# EAGLE design STM32_H103_Extension (EAGLE 6.4)
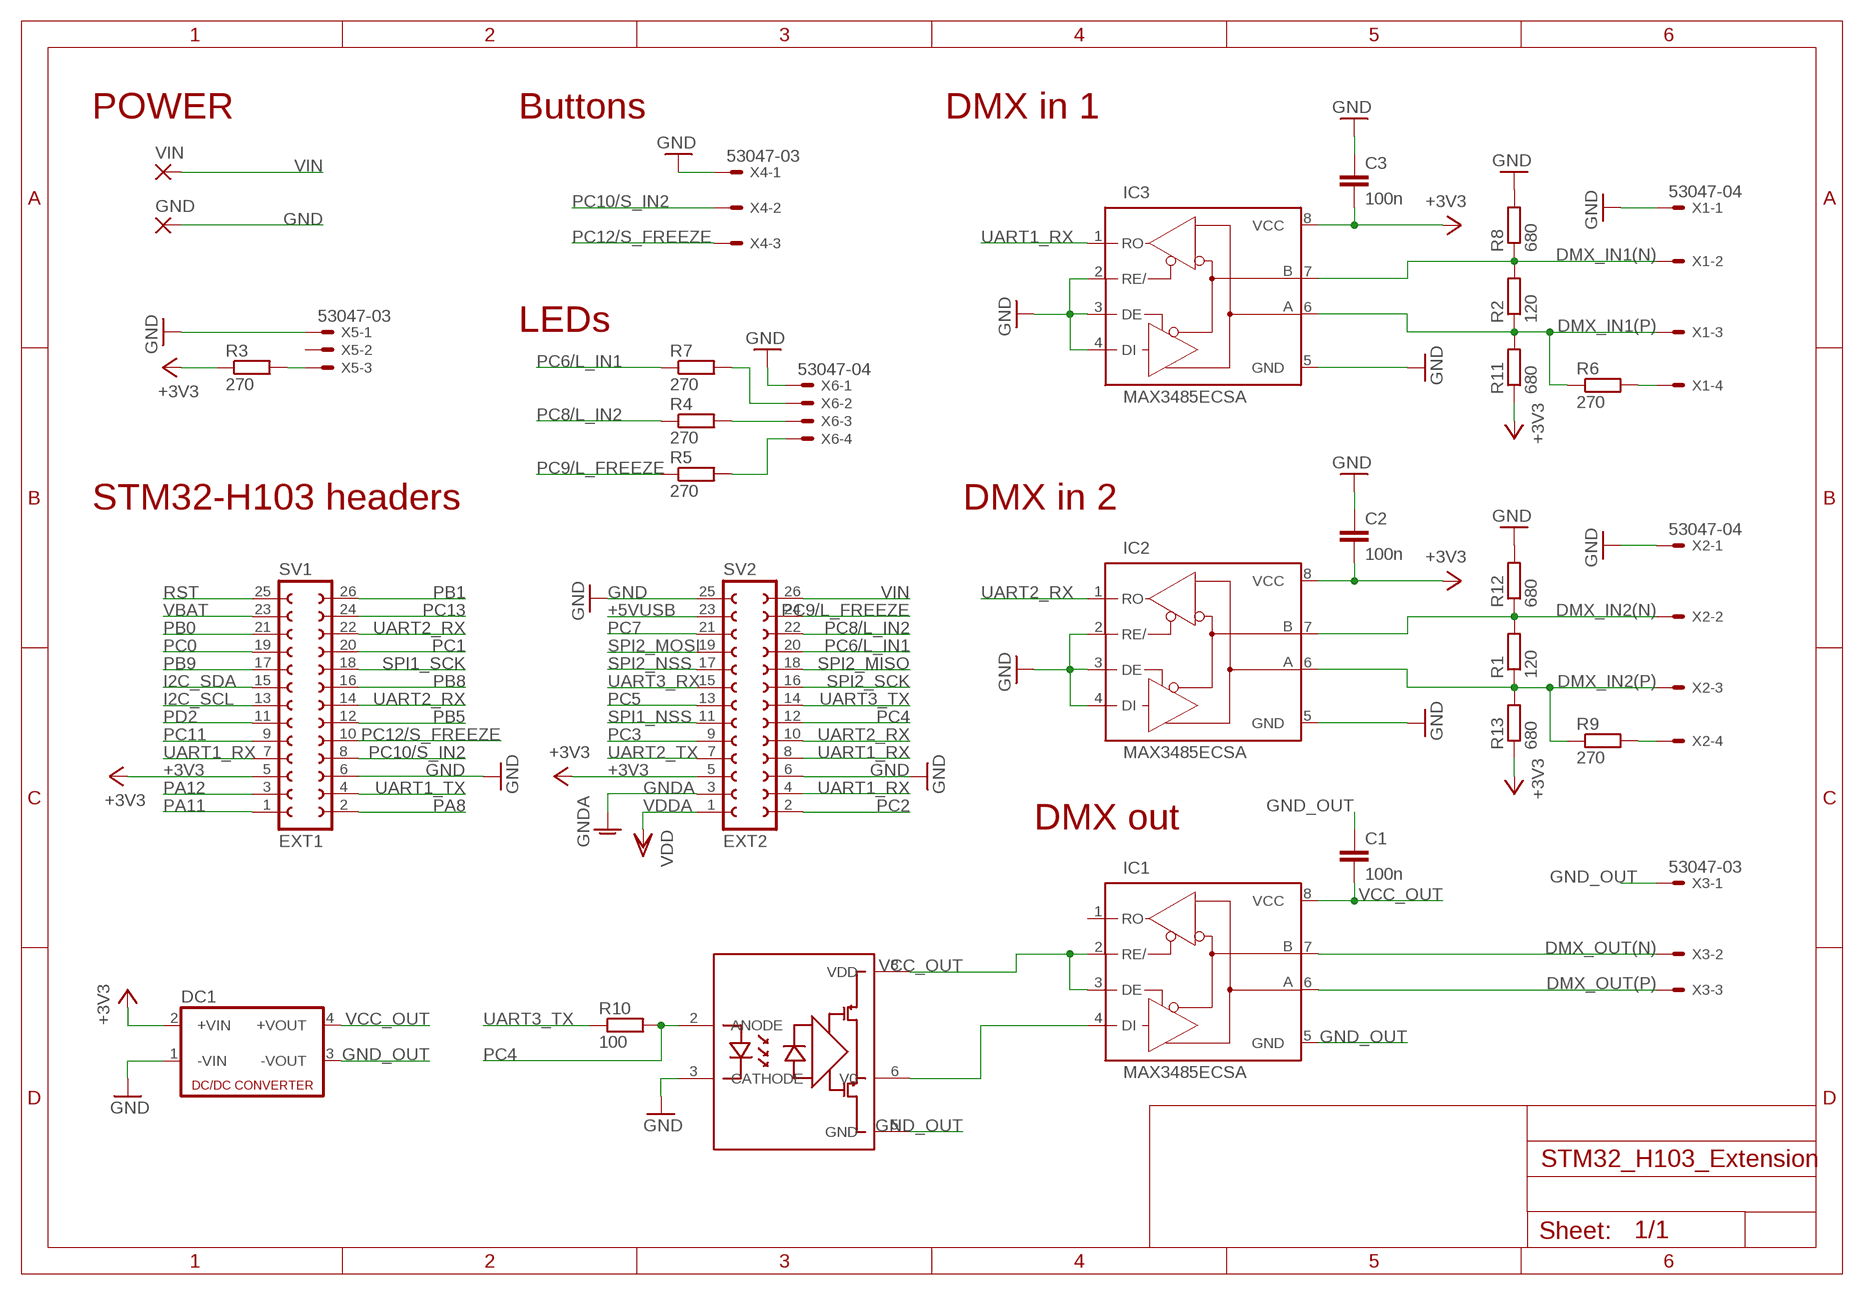
[diagram p0: schematic, sheet 1]

## Parts
C1  100n  C-EUC0603  [C0603]
C2  100n  C-EUC0603  [C0603]
C3  100n  C-EUC0603  [C0603]
DC1  NME  [NME]
GND  2,15/1,0  [2,15/1,0]
IC1  MAX3485ECSA  MAX3468ESA  [SO08]
IC2  MAX3485ECSA  MAX3468ESA  [SO08]
IC3  MAX3485ECSA  MAX3468ESA  [SO08]
R1  120  R-EU_R0603  [R0603]
R2  120  R-EU_R0603  [R0603]
R3  270  R-EU_R0603  [R0603]
R4  270  R-EU_R0603  [R0603]
R5  270  R-EU_R0603  [R0603]
R6  270  R-EU_R0603  [R0603]
R7  270  R-EU_R0603  [R0603]
R8  680  R-EU_R0603  [R0603]
R9  270  R-EU_R0603  [R0603]
R10  100  R-EU_R0603  [R0603]
R11  680  R-EU_R0603  [R0603]
R12  680  R-EU_R0603  [R0603]
R13  680  R-EU_R0603  [R0603]
SV1  EXT1  FE13-2  [FE13-2]
SV2  EXT2  FE13-2  [FE13-2]
U1  ACPL-071L  [SOIC-8]
VIN  2,15/1,0  [2,15/1,0]
X1  53047-04  [53047-04]
X2  53047-04  [53047-04]
X3  53047-03  [53047-03]
X4  53047-03  [53047-03]
X5  53047-03  [53047-03]
X6  53047-04  [53047-04]

## Nets
+3V3 [supply]: C2.2 C3.2 DC1.2(+VIN) IC2.8(VCC) IC3.8(VCC) R3.1 R11.1 R13.1 SV1.5 SV2.5
+5VUSB: SV2.23
DMX_IN1(N): IC3.7(B) R2.2 R8.1 X1.2
DMX_IN1(P): IC3.6(A) R2.1 R6.1 R11.2 X1.3
DMX_IN2(N): IC2.7(B) R1.2 R12.1 X2.2
DMX_IN2(P): IC2.6(A) R1.1 R9.1 R13.2 X2.3
DMX_OUT(N): IC1.7(B) X3.2
DMX_OUT(P): IC1.6(A) X3.3
GND: C2.1 C3.1 DC1.1(-VIN) GND.1(P) IC2.2(RE/) IC2.3(DE) IC2.4(DI) IC2.5(GND) IC3.2(RE/) IC3.3(DE) IC3.4(DI) IC3.5(GND) R8.2 R12.2 SV1.6 SV2.6 SV2.25 U1.3(CATHODE) X1.1 X2.1 X4.1 X5.1 X6.1
GND_OUT: C1.1 DC1.3(-VOUT) IC1.5(GND) U1.5(GND) X3.1
GNDA: SV2.3
I2C_SCL: SV1.13
I2C_SDA: SV1.15
N$1: R3.2 X5.3
N$2: R4.2 X6.3
N$3: R5.2 X6.4
N$4: R7.2 X6.2
N$5: IC1.4(DI) U1.6(V0)
N$7: R6.2 X1.4
N$8: R9.2 X2.4
PA8: SV1.2
PA11: SV1.1
PA12: SV1.3
PB0: SV1.21
PB1: SV1.26
PB5: SV1.12
PB8: SV1.16
PB9: SV1.17
PC0: SV1.19
PC1: SV1.20
PC2: SV2.2
PC3: SV2.9
PC4: R10.2 SV2.12 U1.2(ANODE)
PC5: SV2.13
PC6/L_IN1: R7.1 SV2.20
PC7: SV2.21
PC8/L_IN2: R4.1 SV2.22
PC9/L_FREEZE: R5.1 SV2.24
PC10/S_IN2: SV1.8 X4.2
PC11: SV1.9
PC12/S_FREEZE: SV1.10 X4.3
PC13: SV1.24
PD2: SV1.11
RST: SV1.25
SPI1_NSS: SV2.11
SPI1_SCK: SV1.18
SPI2_MISO: SV2.18
SPI2_MOSI: SV2.19
SPI2_NSS: SV2.17
SPI2_SCK: SV2.16
UART1_RX: IC3.1(RO) SV1.7 SV2.4 SV2.8
UART1_TX: SV1.4
UART2_RX: IC2.1(RO) SV1.14 SV1.22 SV2.10
UART2_TX: SV2.7
UART3_RX: SV2.15
UART3_TX: R10.1 SV2.14
VBAT: SV1.23
VCC_OUT [supply]: C1.2 DC1.4(+VOUT) IC1.2(RE/) IC1.3(DE) IC1.8(VCC) U1.8(VDD)
VDDA: SV2.1 ; supply symbol labelled VDD
VIN: SV2.26 VIN.1(P)
Unconnected: IC1.1(RO) X5.2

## Notes on the sheet
- POWER | Buttons | DMX in 1
- LEDs
- STM32-H103 headers | DMX in 2
- DMX out

## Library data of the parts
C1-C3 = resistor:C-EU: CAPACITOR, European symbol
DC1 = dc-dc-converter:NME: DC-DC CONVERTER; MF: C & D TECHNOLOGIES, INC; MPN: NME1205D; OC_FARNELL: 1021466; OC_NEWARK: 98B8198
GND VIN = wirepad:2,15/1,0: THROUGH-HOLE PAD
IC1-IC3 = maxim:MAX34*: +5V, Fail-Safe, 40Mbps, Profibus RS-485/RS-422 Transceivers Source: MAX3465-MAX3469.pdf; MPN: MAX3468ESA+T; OC_FARNELL: unknown; OC_NEWARK: 76K6724
R1-R13 = resistor:R-EU_: RESISTOR, European symbol
SV1 SV2 = con-lsta:FE13-2: FEMALE HEADER; OC_FARNELL: unknown; OC_NEWARK: unknown
U1 = ACPL-071L:ACPL-071L
X1 X2 X6 = con-molex:53?-04: CONNECTOR wire to board 1.25 mm (.049 inch) pitch header; MF: WALDOM/MOLEX; MPN: 53047-0410; OC_FARNELL: 9733060; OC_NEWARK: 38C9900
X3-X5 = con-molex:53?-03: CONNECTOR wire to board 1.25 mm (.049 inch) pitch header; MPN: 530470310; OC_FARNELL: 9732853; OC_NEWARK: 14R5412

## Net classes
1 supply: width 0.305 mm, clearance 0.254 mm

## Board
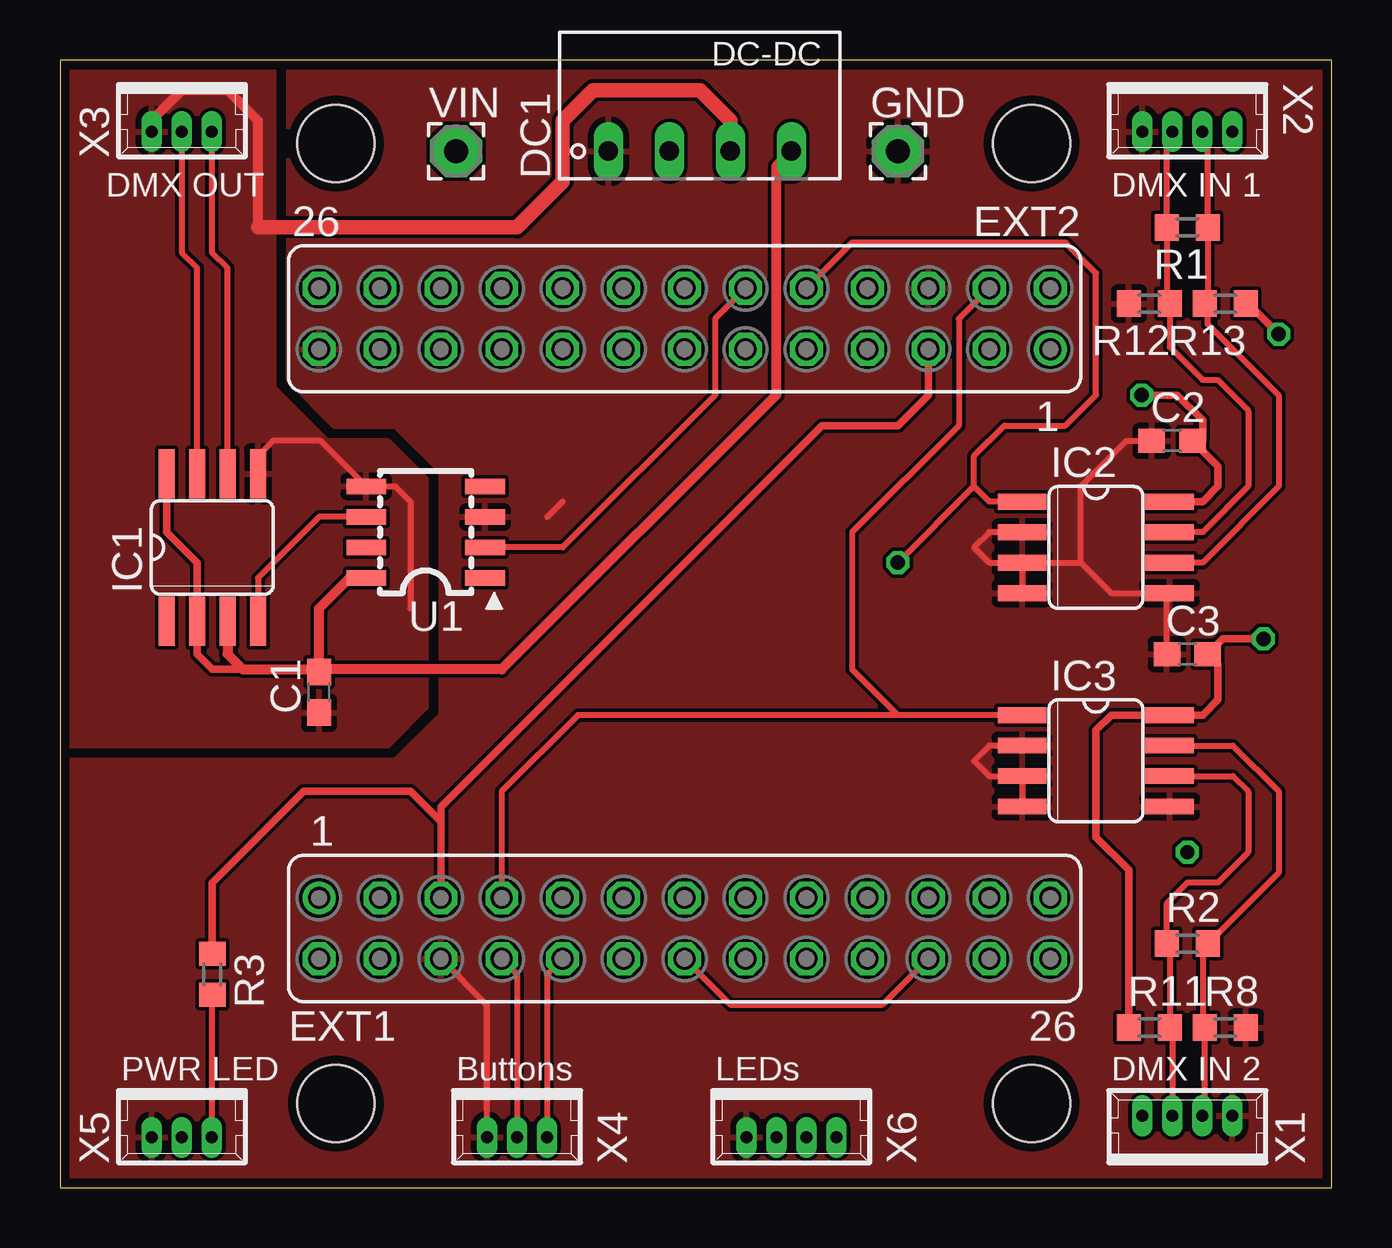
[diagram p1: board, top side]
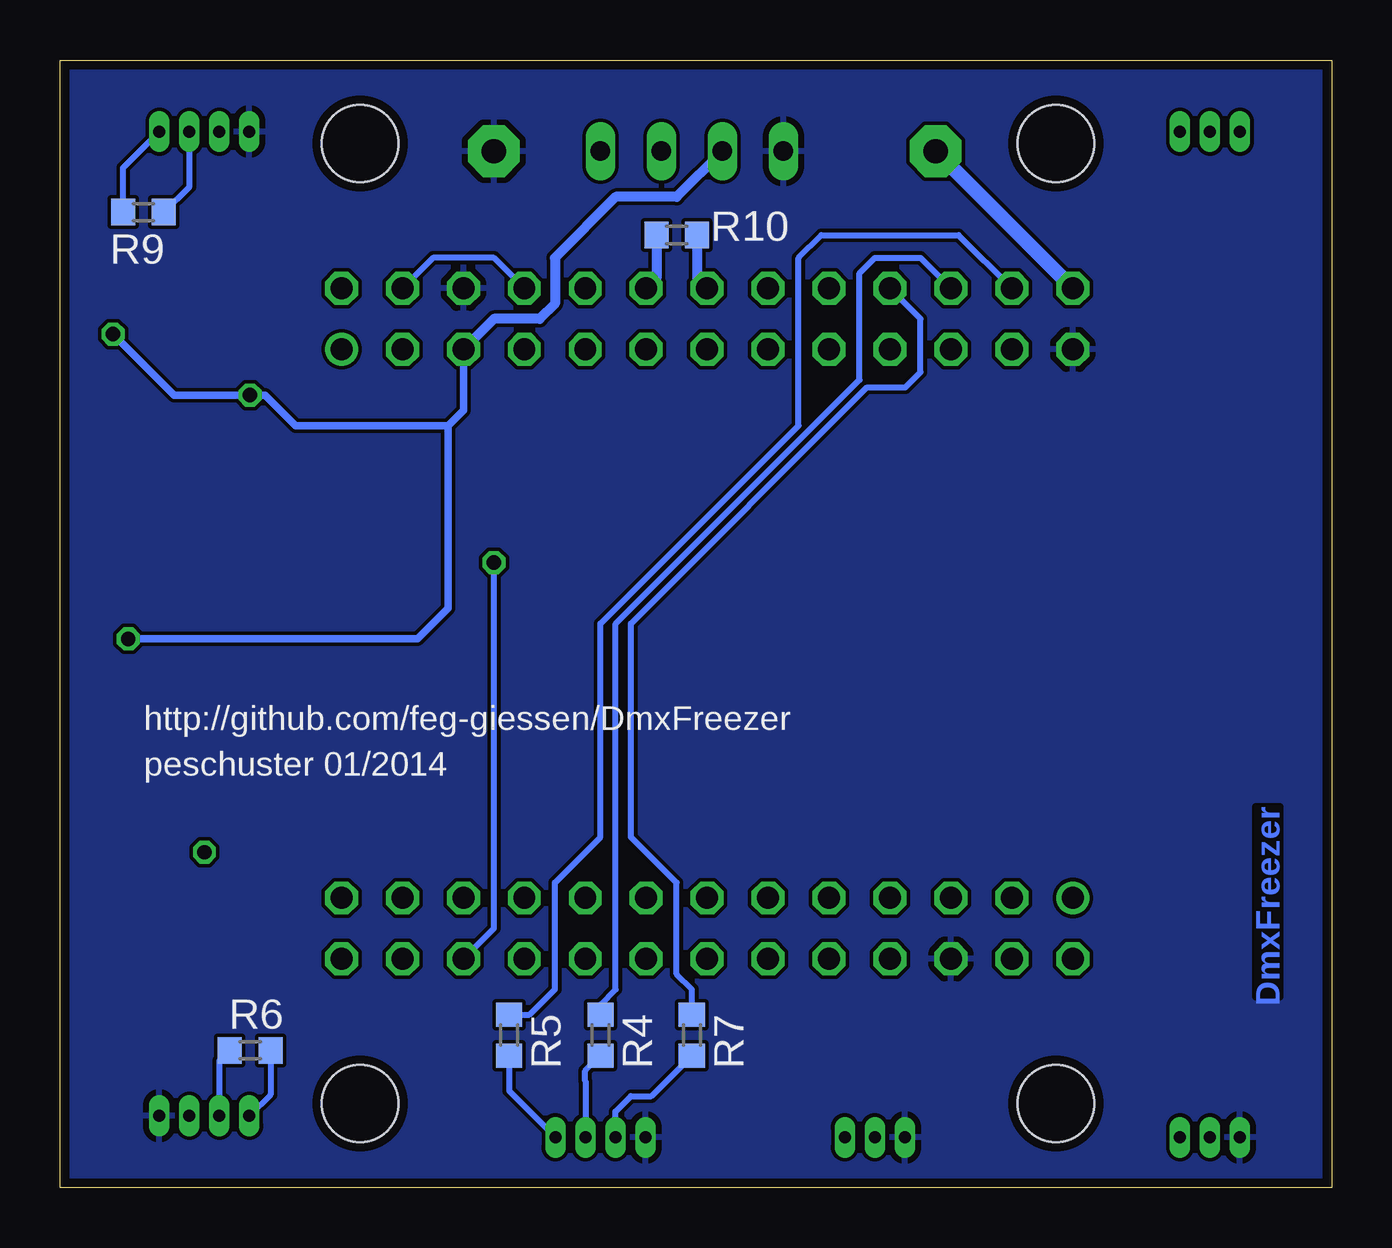
[diagram p2: board, bottom side, seen from below]

Size 53.01 x 46.98 mm. Coordinates in mm from the lower left corner, seen from the top.
Outline: 0,0 53.01,0 53.01,46.98 0,46.98 0,0
Copper layers (1*16): Top 0.0356mm / dielectric 1.5011mm / Bottom 0.0356mm
Design rules "OshPark_PCBOrder *": minimum track width 6mil, minimum drill 13mil, track to track 6mil, track to pad 6mil, pad to pad 6mil, via to via 6mil, smd to smd 6mil, copper to edge 15mil, drill to drill 6mil, minimum pad ring 7mil, minimum via ring 7mil, stop-mask expansion 4mil, vias tented up to drill 0mil, thermal gap 10mil
Holes 3.2 mm at 40.5,3.5 11.5,3.5 11.5,43.5 40.5,43.5

### Footprints (pad centres in the part's own frame; a part is rotated, then mirrored left to right if it is on the bottom)
C0603 = smd 1.1 x 1: 1 -0.85,0; 2 0.85,0
NME = drill 0.813 long: 1 0,3.81; 2 0,1.27; 3 0,-1.27; 4 0,-3.81
2,15/1,0 = drill 1.016 pad 2.159 octagon: 1 0,0
SO08 = smd 0.66 x 2.032: 1 -1.905,-3.073; 2 -0.635,-3.073; 3 0.635,-3.073; 4 1.905,-3.073; 5 1.905,3.073; 6 0.635,3.073; 7 -0.635,3.073; 8 -1.905,3.073
R0603 = smd 1 x 1.1: 1 -0.85,0; 2 0.85,0
FE13-2 = drill 0.914: 1 -15.24,1.27 | drill 0.914 octagon: 2 -15.24,-1.27; 3 -12.7,1.27; 4 -12.7,-1.27; 5 -10.16,1.27; 6 -10.16,-1.27; 7 -7.62,1.27; 8 -7.62,-1.27; 9 -5.08,1.27; 10 -5.08,-1.27; 11 -2.54,1.27; 12 -2.54,-1.27; 13 0,1.27; 14 0,-1.27; 15 2.54,1.27; 16 2.54,-1.27; 17 5.08,1.27; 18 5.08,-1.27; 19 7.62,1.27; 20 7.62,-1.27; 21 10.16,1.27; 22 10.16,-1.27; 23 12.7,1.27; 24 12.7,-1.27; 25 15.24,1.27; 26 15.24,-1.27
SOIC-8 = smd 0.635 x 1.651: 1 -1.905,-2.477; 2 -0.635,-2.477; 3 0.635,-2.477; 4 1.905,-2.477; 5 1.905,2.477; 6 0.635,2.477; 7 -0.635,2.477; 8 -1.905,2.477
53047-04 = drill 0.5 pad 0.698 long: 1 1.875,0.45; 2 0.625,0.45; 3 -0.625,0.45; 4 -1.875,0.45
53047-03 = drill 0.5 pad 0.698 long: 1 1.25,0.45; 2 0,0.45; 3 -1.25,0.45

### Placement (x,y rotation side)
C1  10.79,20.64 90 top
C2  46.35,31.11 0 top
C3  46.99,22.23 0 top
DC1  26.67,43.18 90 top
GND  34.92,43.18 0 top
IC1  6.35,26.67 0 top
IC2  43.18,26.67 270 top
IC3  43.18,17.78 270 top
R1  46.99,40.01 180 top
R2  46.99,10.16 0 top
R3  6.35,8.89 270 top
R4  30.48,6.35 270 bottom
R5  34.29,6.35 270 bottom
R6  45.09,5.71 0 bottom
R7  26.67,6.35 270 bottom
R8  48.58,6.67 0 top
R9  49.53,40.64 180 bottom
R10  27.3,39.69 180 bottom
R11  45.4,6.67 0 top
R12  45.4,36.83 180 top
R13  48.58,36.83 180 top
SV1  26.04,10.79 0 top
SV2  26.04,36.2 180 top
U1  15.24,27.3 90 top
VIN  16.51,43.18 0 top
X1  46.99,2.54 0 top
X2  46.99,44.45 180 top
X3  5.08,44.45 180 top
X4  19.05,2.54 180 top
X5  5.08,2.54 180 top
X6  30.48,2.54 180 top

### Tracks (layer width: path | path; a pad name or v marks a point on that pad's centre or on a via)
+3V3  (via drill 0.6)
  Top 0.305: IC2.8 47.62,28.57 48.26,29.21 48.26,30.06 C2.2 | v45.09,33.02 46.57,33.02 47.62,31.96 47.62,31.11 C2.2 | 46.99,31.11 C2.2 | 15.88,15.24 14.61,16.51 10.16,16.51 6.35,12.7 R3.1 | 15.88,15.24 SV1.5 | 15.88,15.24 15.88,15.88 31.75,31.75 34.92,31.75 36.2,33.02 SV2.5 | v50.16,22.86 48.48,22.86 C3.2 48.26,21.8 48.26,20.32 47.62,19.68 IC3.8 43.81,19.68 43.18,19.05 43.18,14.61 44.55,13.23 R11.1 | R13.1 49.53,36.83 v50.8,35.56
  Bottom 0.305: SV2.5 36.2,32.38 36.83,31.75 | 36.83,31.75 43.18,31.75 44.45,33.02 v45.09,33.02 48.26,33.02 v50.8,35.56 | v50.16,22.86 38.1,22.86 36.83,24.13 36.83,31.75
  Bottom 0.406: DC1.2 27.3,41.27 29.84,41.27 32.38,38.73 32.38,36.83 33.02,36.2 34.92,36.2 SV2.5
DMX_IN1(N)
  Top 0.254: IC3.7 48.9,18.41 50.8,16.51 50.8,13.12 R2.2 47.62,9.95 47.62,6.77 R8.1 47.73,3.1 X1.2
DMX_IN1(P)
  Top 0.254: IC3.6 48.9,17.14 49.53,16.51 49.53,13.97 48.26,12.7 46.99,12.7 46.14,11.85 R2.1 46.38,9.93 46.25,9.8 R11.2 46.37,6.55 X1.3
  Bottom 0.254: R6.1 46.37,5.29 X1.3
DMX_IN2(N)
  Top 0.254: IC2.7 47.62,27.3 49.53,29.21 49.53,32.38 48.26,33.66 47.62,33.66 46.25,35.03 R12.1 46.14,36.94 R1.2 46.14,43.77 X2.2
DMX_IN2(P)
  Top 0.254: IC2.6 47.62,26.04 50.8,29.21 50.8,33.02 47.84,35.98 47.84,36.72 R13.2 47.84,36.94 R1.1 47.84,43.77 X2.3
  Bottom 0.254: R9.1 47.61,41.71 47.61,43.18 47.62,43.18 X2.3
DMX_OUT(N)
  Top 0.254: X3.2 5.08,38.95 5.71,38.31 IC1.7
DMX_OUT(P)
  Top 0.254: X3.3 6.33,38.97 6.99,38.31 IC1.6
GND
  Top 0.254: IC3.2 38.73,18.41 38.1,17.78 38.73,17.14 IC3.3 IC3.4 | IC2.2 38.73,27.3 38.1,26.67 38.73,26.04 IC2.3 | IC2.3 42.55,26.04 | 42.55,26.04 43.81,24.77 IC2.5 46.14,24.65 C3.1 | 42.55,26.04 42.55,29.21 44.45,31.11 C2.1 | IC2.3 IC2.4 | SV1.6 17.78,7.62 17.78,2.54 | 20.32,27.94 20.95,28.57
  pour Top: 9.53,50.16 9.53,33.66 11.43,31.75 13.97,31.75 15.88,29.84 15.88,19.68 13.97,17.78 -1.27,17.78 -1.27,-1.27 54.61,-1.27 54.61,50.16
  pour Bottom: -0.64,48.9 -0.64,-0.64 53.34,-0.64 53.34,49.53
GND_OUT
  Top 0.254: IC1.5 8.26,30.48 8.89,31.11 10.86,31.11 U1.5 13.97,29.21 14.61,28.57 14.61,24.13
  Top 0.406: 8.26,40.01 8.26,44.45 6.99,45.72 5.08,45.72 3.83,44.47 X3.1
  Top 0.61: DC1.3 27.94,44.45 26.67,45.72 22.23,45.72 20.95,44.45 20.95,41.91 19.05,40.01 8.26,40.01
  pour Top: -1.27,50.16 8.89,50.16 8.89,33.34 11.11,31.11 13.65,31.11 15.24,29.53 15.24,20 13.65,18.41 -1.27,18.41
N$1
  Top 0.254: X5.3 6.35,2.11 R3.2
N$2
  Bottom 0.254: X6.3 31.11,4.43 31.11,4.45 31.11,4.87 R4.2
N$3
  Bottom 0.254: R5.2 34.29,4.03 X6.4
N$4
  Bottom 0.254: R7.2 28.36,3.81 29.21,3.81 29.86,3.17 X6.2
N$5
  Top 0.254: U1.6 10.79,27.94 8.26,25.4 IC1.4
N$6  (via drill 0.6)
  other vias: 46.99,13.97
N$7
  Bottom 0.254: R6.2 44.23,3.87 X1.4
N$8
  Bottom 0.254: R9.2 50.38,42.48 X2.4
PC4
  Top 0.254: SV2.12 27.3,36.2 27.3,33.02 20.95,26.67 U1.2
  Bottom 0.406: R10.2 28.16,37.88 SV2.12
PC6/L_IN1
  Bottom 0.254: R7.1 26.67,8.26 27.3,8.89 27.3,12.7 29.21,14.61 29.21,23.5 19.37,33.34 17.78,33.34 17.14,33.97 17.14,36.2 SV2.20
PC8/L_IN2
  Bottom 0.254: R4.1 30.48,7.62 29.84,8.26 29.84,23.5 19.68,33.66 19.68,38.1 19.05,38.73 17.14,38.73 SV2.22
PC9/L_FREEZE
  Bottom 0.254: R5.1 33.44,7.2 32.38,8.26 32.38,12.7 30.48,14.61 30.48,23.5 22.23,31.75 22.23,38.73 21.27,39.69 15.56,39.69 SV2.24
PC10/S_IN2
  Top 0.254: SV1.8 19.05,8.89 X4.2
PC12/S_FREEZE
  Top 0.254: SV1.10 20.3,8.87 X4.3
UART1_RX
  Top 0.254: IC3.1 34.92,19.68 | 34.92,19.68 21.59,19.68 18.41,16.51 SV1.7 | SV2.4 37.47,36.2 37.47,31.75 33.02,27.3 33.02,21.59 34.92,19.68
  Bottom 0.254: SV2.8 34.92,38.73 37.47,38.73 SV2.4
UART2_RX  (via drill 0.6)
  Top 0.254: IC2.1 38.73,28.57 38.1,29.21 | 38.1,29.21 38.1,30.48 39.37,31.75 41.91,31.75 43.18,33.02 43.18,38.1 41.91,39.37 33.02,39.37 SV2.10 | SV1.14 27.94,7.62 34.29,7.62 SV1.22 | v34.92,26.04 38.1,29.21
  Bottom 0.254: SV1.22 34.92,10.79 v34.92,26.04
UART3_TX
  Bottom 0.406: R10.1 26.45,37.88 SV2.14
VCC_OUT
  Top 0.305: IC1.8 4.45,27.3 5.71,26.04 IC1.2 5.71,22.23 6.35,21.59 8.26,21.59
  Top 0.406: U1.8 12.06,25.4 10.79,24.13 C1.2 10.79,21.59 | IC1.3 6.99,22.23 7.62,21.59 8.26,21.59 10.79,21.59 | DC1.4 29.84,42.55 29.84,33.02 18.41,21.59 10.79,21.59
VIN
  Bottom 0.61: SV2.26 VIN.1

### Text on the board
Bottom: DmxFreezer
tNames: DMX OUT | DMX IN 1 | PWR LED | Buttons | LEDs | DMX IN 2
bNames: http://github.com/feg-giessen/DmxFreezer | peschuster 01/2014